# Altium schematic sheet Sheet1.SchDoc
size A4
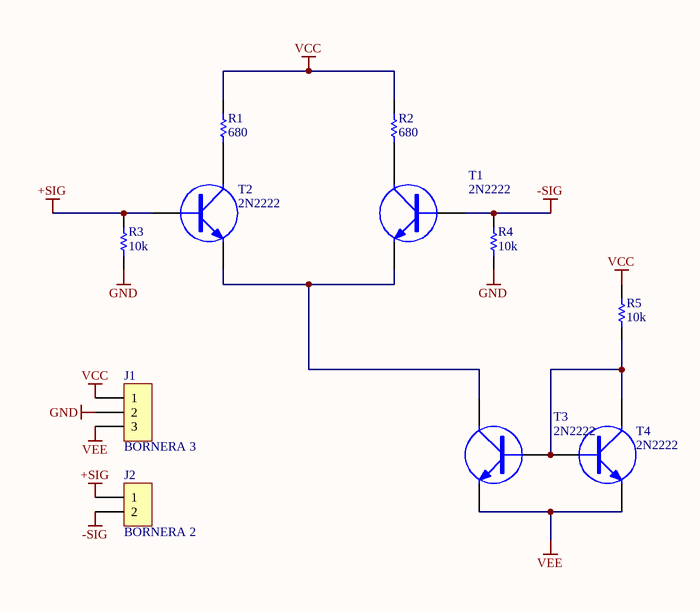
[diagram p0: Sheet1.SchDoc]

## Parts
J1  BORNERA 3  [BORNERA3]
J2  BORNERA 2  [BORNERA2]
R1  680  [RES300]
R2  680  [RES300]
R3  10k  [RES300]
R4  10k  [RES300]
R5  10k  [RES300]
T1  2N2222  [TO92]
T2  2N2222  [TO92]
T3  2N2222  [TO92]
T4  2N2222  [TO92]

## Nets
+SIG: J2.1 R3.2 T2.1(B)
-SIG: J2.2 R4.2 T1.1(B)
GND: J1.2 R3.1 R4.1
VCC: J1.1 R1.2 R2.2 R5.2
VEE: J1.3 T3.3(E) T4.3(E)
NetR1_1: R1.1 T2.2(C)
NetR2_1: R2.1 T1.2(C)
NetR5_1: R5.1 T3.1(B) T4.1(B) T4.2(C)
NetT1_3: T1.3(E) T2.3(E) T3.2(C)

## Library data of the parts
R1-R5 = RES
T1-T4 = TRANSISTOR NPN